# EAGLE schematic schema (EAGLE 9.6.0)
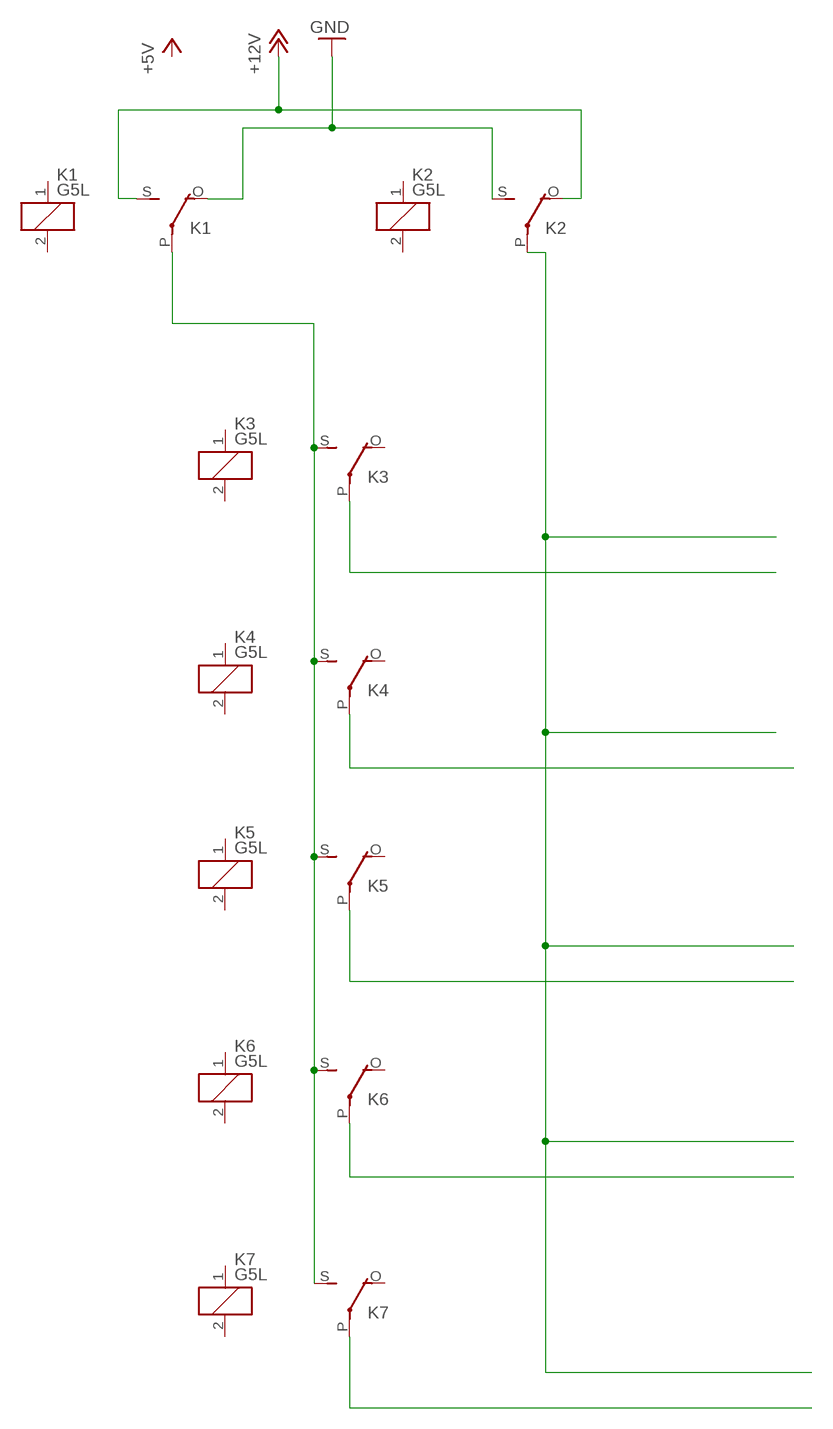
[diagram p0: schematic, sheet 1]

## Parts
K1  G5L  [G5LE]
K2  G5L  [G5LE]
K3  G5L  [G5LE]
K4  G5L  [G5LE]
K5  G5L  [G5LE]
K6  G5L  [G5LE]
K7  G5L  [G5LE]

## Nets
+12V: K1.S(2:S) K2.O(2:O)
GND: K1.O(2:O) K2.S(2:S)
N$1: K1.P(2:P) K3.S(2:S) K4.S(2:S) K5.S(2:S) K6.S(2:S) K7.S(2:S)
N$2: K3.P(2:P)
N$3: K2.P(2:P)
N$4: K4.P(2:P)
N$5: K5.P(2:P)
N$6: K6.P(2:P)
N$7: K7.P(2:P)
Unconnected: K1.1 K1.2 K2.1 K2.2 K3.1 K3.2 K3.O(2:O) K4.1 K4.2 K4.O(2:O) K5.1 K5.2 K5.O(2:O) K6.1 K6.2 K6.O(2:O) K7.1 K7.2 K7.O(2:O)

## Library data of the parts
K1-K7 = relay:G5L: RELAY 1 x switch, 10 A/120 V AC, 8 A/30 V ADC, Omron; OC_FARNELL: unknown; OC_NEWARK: unknown